# EAGLE design ENGI301_Maze_Project_frame (EAGLE 8.7.1)
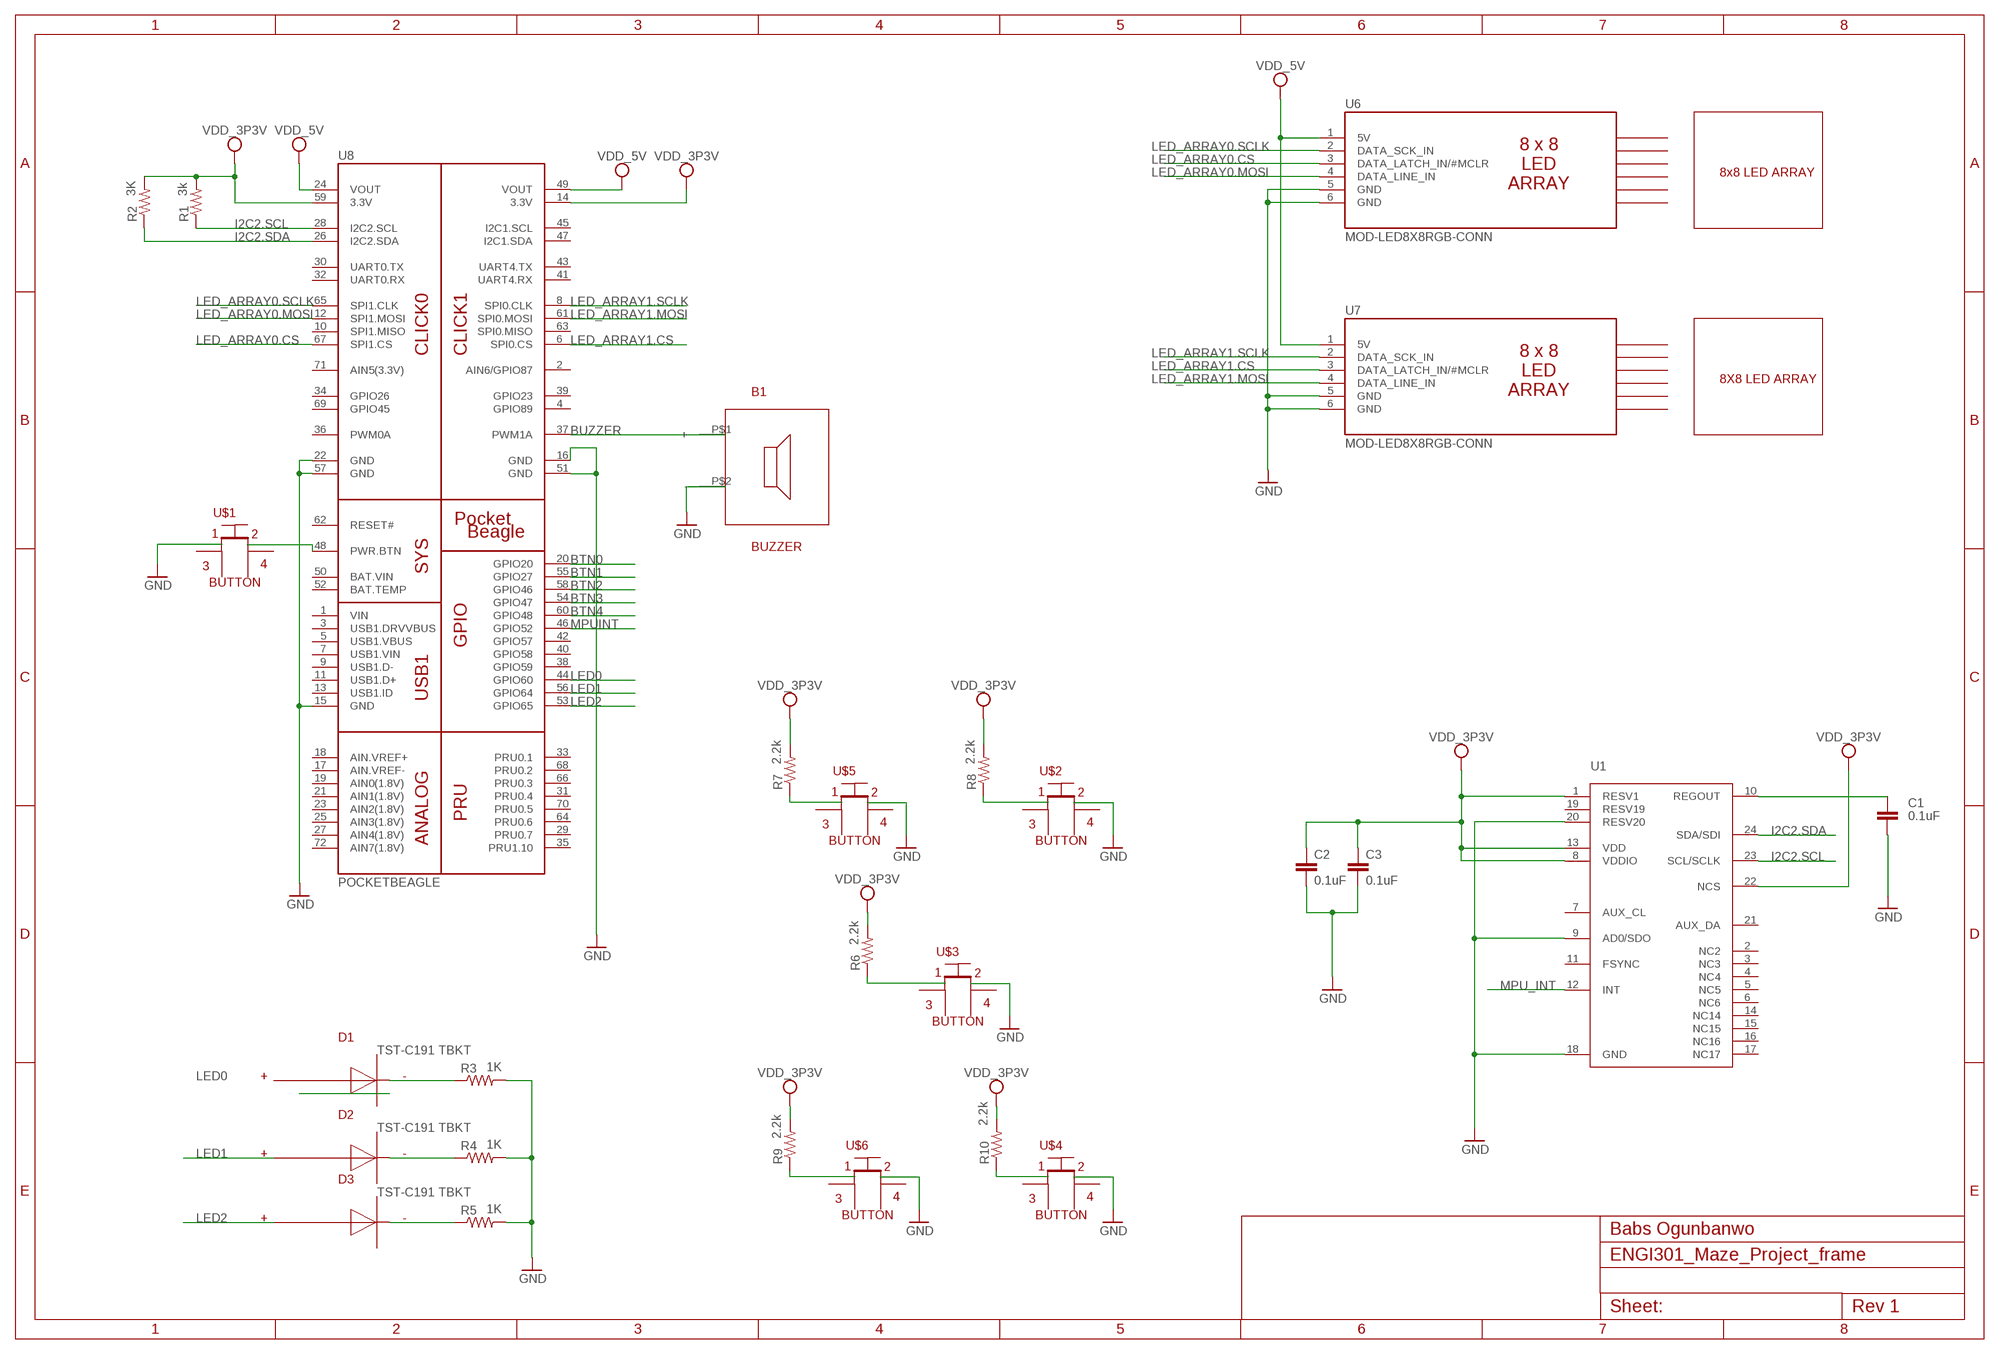
[diagram p0: schematic, sheet 1]

## Parts
B1  BUZZER  [BUZZER]
C1  0.1uF  C_C0603  [C0603]
C2  0.1uF  C_C0603  [C0603]
C3  0.1uF  C_C0603  [C0603]
D1  TST-C191 TBKT  LED  [LED]
D2  TST-C191 TBKT  LED  [LED]
D3  TST-C191 TBKT  LED  [LED]
R1  3k  R_R0603  [R0603]
R2  3K  R_R0603  [R0603]
R3  1K  R_R0603  [R0603]
R4  1K  R_R0603  [R0603]
R5  1K  R_R0603  [R0603]
R6  2.2k  R_R0603  [R0603]
R7  2.2k  R_R0603  [R0603]
R8  2.2k  R_R0603  [R0603]
R9  2.2k  R_R0603  [R0603]
R10  2.2k  R_R0603  [R0603]
U1  MPU-9250  [QFN-3MMX3MM]
U6  MOD-LED8X8RGB-CONN  [FE06W]
U7  MOD-LED8X8RGB-CONN  [FE06W]
U8  POCKETBEAGLE  [POCKETBEAGLE]
U$1  BUTTON  [BUTTON]
U$2  BUTTON  [BUTTON]
U$3  BUTTON  [BUTTON]
U$4  BUTTON  [BUTTON]
U$5  BUTTON  [BUTTON]
U$6  BUTTON  [BUTTON]

## Nets
BTN0: U8.20(GPIO20)
BTN1: U8.55(GPIO27)
BTN2: U8.58(GPIO46)
BTN3: U8.54(GPIO47)
BTN4: U8.60(GPIO48)
BUZZER: B1.P$1(+) U8.37(PWM1A)
GND: B1.P$2(-) C1.2 C2.2 C3.2 R3.2 R4.2 R5.2 U1.9(AD0/SDO) U1.20(RESV20) U6.5(GND) U6.6(GND) U7.5(GND) U7.6(GND) U8.15(GND) U8.16(GND) U8.22(GND) U8.51(GND) U8.57(GND) U$1.P$1 U$2.P$2 U$3.P$2 U$4.P$2 U$5.P$2 U$6.P$2
I2C2.SCL: R1.1 U1.23(SCL/SCLK) U8.28(I2C2.SCL)
I2C2.SDA: R2.1 U1.24(SDA/SDI) U8.26(I2C2.SDA)
LED0: D1.+ U8.44(GPIO60)
LED1: D2.+ U8.56(GPIO64)
LED2: D3.+ U8.53(GPIO65)
LED_ARRAY0.CS: U6.3(DATA_LATCH_IN/#MCLR) U8.67(SPI1.CS)
LED_ARRAY0.MOSI: U6.4(DATA_LINE_IN) U8.12(SPI1.MOSI)
LED_ARRAY0.SCLK: U6.2(DATA_SCK_IN) U8.65(SPI1.CLK)
LED_ARRAY1.CS: U7.3(DATA_LATCH_IN/#MCLR) U8.6(SPI0.CS)
LED_ARRAY1.MOSI: U7.4(DATA_LINE_IN) U8.61(SPI0.MOSI)
LED_ARRAY1.SCLK: U7.2(DATA_SCK_IN) U8.8(SPI0.CLK)
MPU_INT: U1.12(INT)
MPUINT: U8.46(GPIO52)
N$2: C1.1 U1.10(REGOUT)
N$3: U8.48(PWR.BTN) U$1.P$2
N$4: U1.18(GND)
N$5: D1.- R3.1
N$6: D2.- R4.1
N$7: D3.- R5.1
N$8: R7.1 U$5.P$1
N$9: R8.1 U$2.P$1
N$10: R6.1 U$3.P$1
N$11: R9.1 U$6.P$1
N$12: R10.1 U$4.P$1
SYS_VDD1_3P3V: C2.1 C3.1 R1.2 R2.2 R6.2 R7.2 R8.2 R9.2 R10.2 U1.1(RESV1) U1.8(VDDIO) U1.13(VDD) U1.22(NCS) U6.1(5V) U7.1(5V) U8.14(3.3V) U8.24(VOUT) U8.49(VOUT) U8.59(3.3V) ; supply symbol labelled VDD_5V, VDD_3P3V
Unconnected: U1.2(NC2) U1.3(NC3) U1.4(NC4) U1.5(NC5) U1.6(NC6) U1.7(AUX_CL) U1.11(FSYNC) U1.14(NC14) U1.15(NC15) U1.16(NC16) U1.17(NC17) U1.19(RESV19) U1.21(AUX_DA) U8.1(VIN) U8.2(AIN6/GPIO87) U8.3(USB1.DRVVBUS) U8.4(GPIO89) U8.5(USB1.VBUS) U8.7(USB1.VIN) U8.9(USB1.D-) U8.10(SPI1.MISO) U8.11(USB1.D+) U8.13(USB1.ID) U8.17(AIN.VREF-) U8.18(AIN.VREF+) U8.19(AIN0(1.8V)) U8.21(AIN1(1.8V)) U8.23(AIN2(1.8V)) U8.25(AIN3(1.8V)) U8.27(AIN4(1.8V)) U8.29(PRU0.7) U8.30(UART0.TX) U8.31(PRU0.4) U8.32(UART0.RX) U8.33(PRU0.1) U8.34(GPIO26) U8.35(PRU1.10) U8.36(PWM0A) U8.38(GPIO59) U8.39(GPIO23) U8.40(GPIO58) U8.41(UART4.RX) U8.42(GPIO57) U8.43(UART4.TX) U8.45(I2C1.SCL) U8.47(I2C1.SDA) U8.50(BAT.VIN) U8.52(BAT.TEMP) U8.62(RESET#) U8.63(SPI0.MISO) U8.64(PRU0.6) U8.66(PRU0.3) U8.68(PRU0.2) U8.69(GPIO45) U8.70(PRU0.5) U8.71(AIN5(3.3V)) U8.72(AIN7(1.8V)) U$1.P$3 U$1.P$4 U$2.P$3 U$2.P$4 U$3.P$3 U$3.P$4 U$4.P$3 U$4.P$4 U$5.P$3 U$5.P$4 U$6.P$3 U$6.P$4

## Notes on the sheet
- 8x8 LED ARRAY
- 8X8 LED ARRAY
- Babs Ogunbanwo

## Library data of the parts
B1 = ENGI301_design_example final:BUZZER
C1-C3 = ENGI301_design_example final:C_: Capacitor SMD. Sizes: 0402, 0603 & 0805
D1-D3 = ENGI301_design_example final:LED
R1-R10 = ENGI301_design_example final:R_: RESISTOR, American symbol
U1 = ENGI301_design_example final:MPU-9250
U6 U7 = ENGI301_Maze_Project_Parts:MOD-LED8X8RGB-CONN
U8 = ENGI301_Maze_Project_Parts:POCKETBEAGLE
U$1-U$6 = ENGI301_design_example final:BUTTON

## Board
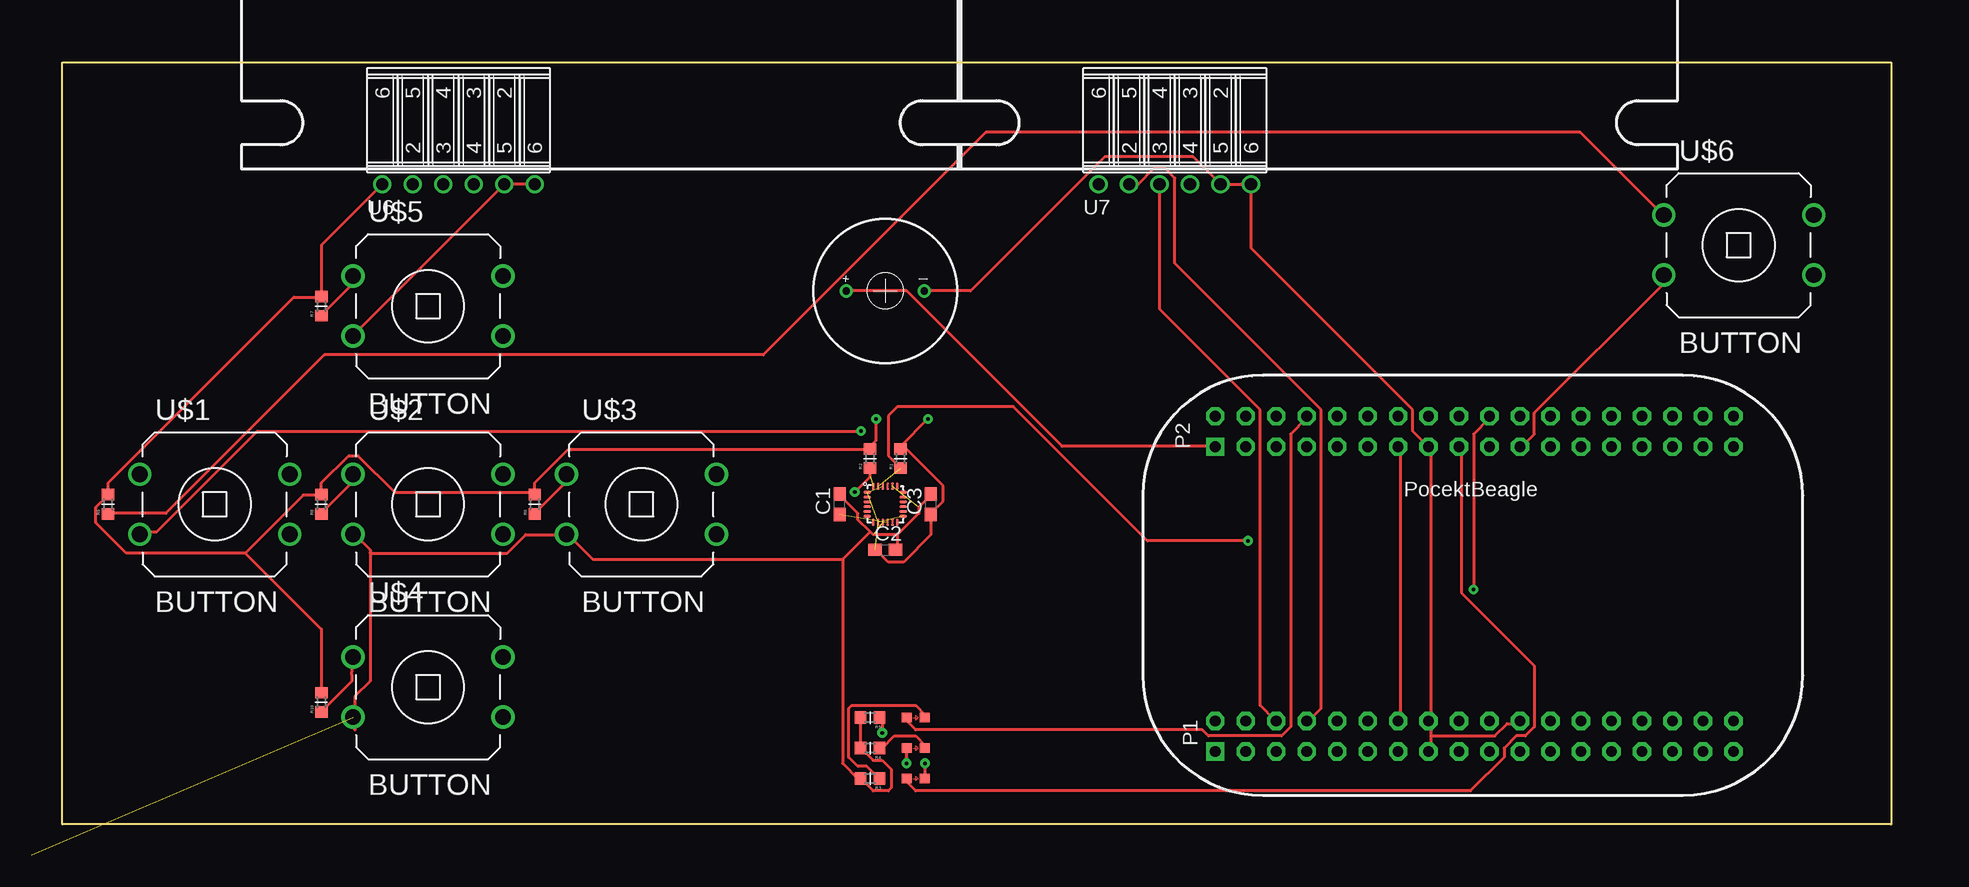
[diagram p1: board, top side]
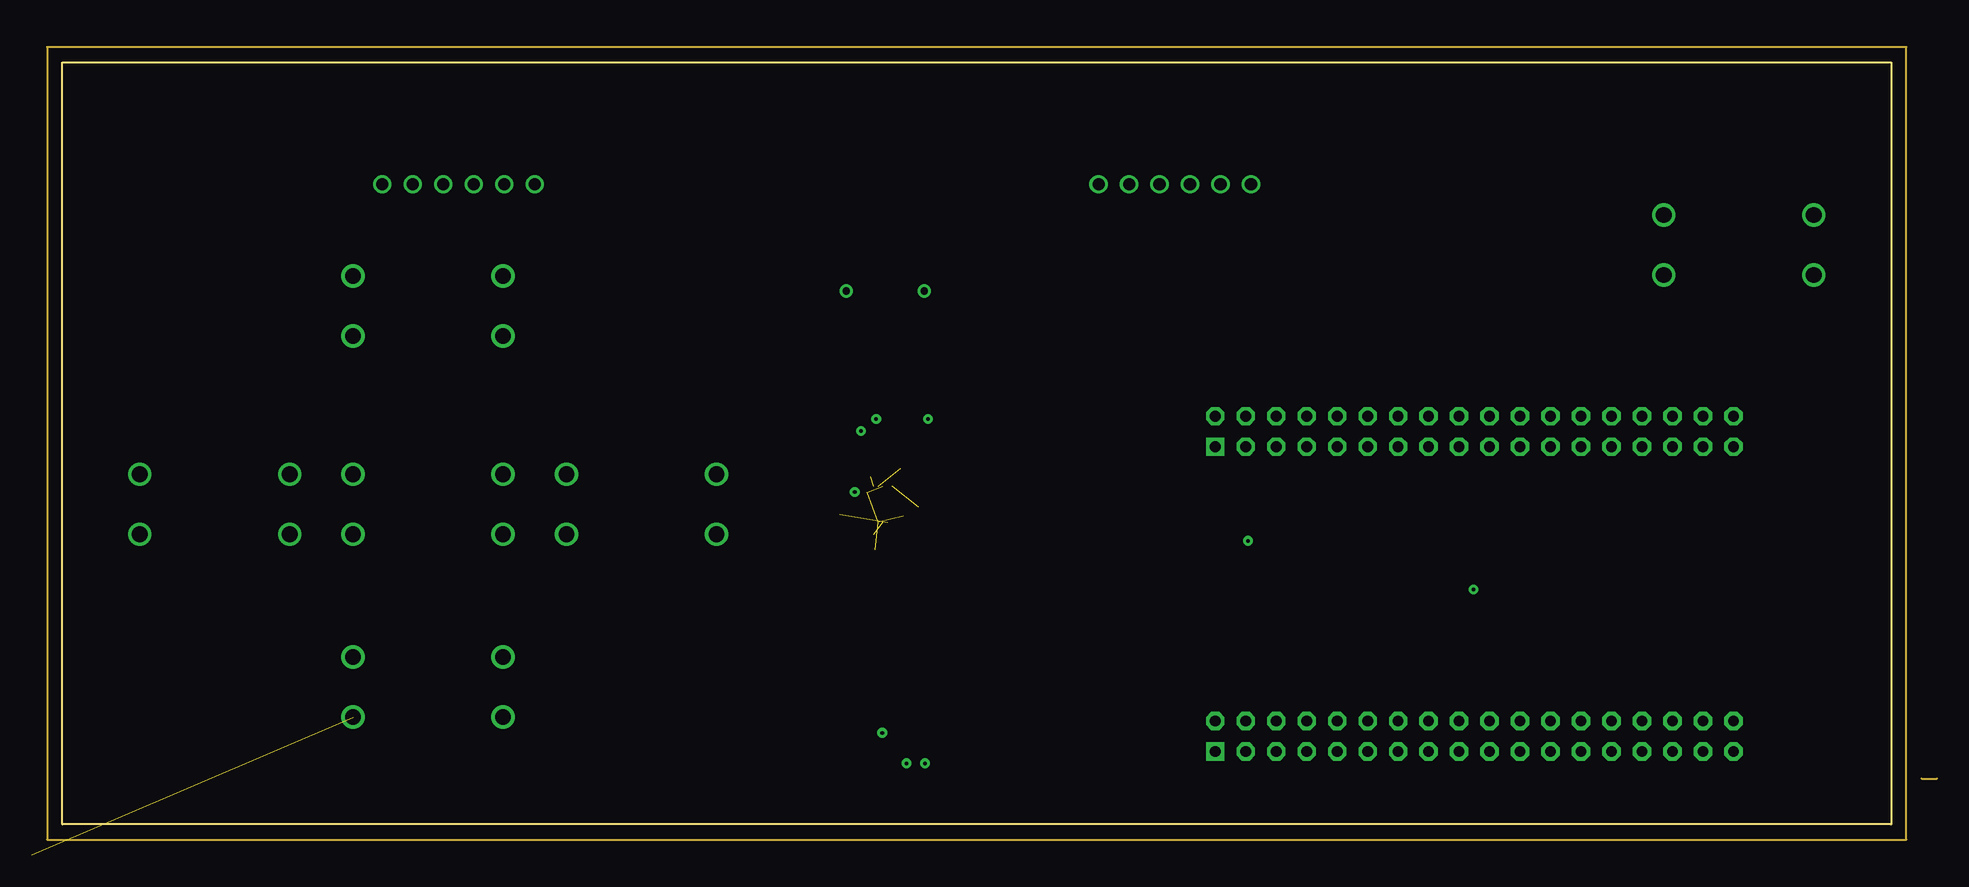
[diagram p2: board, inner layer Route2]
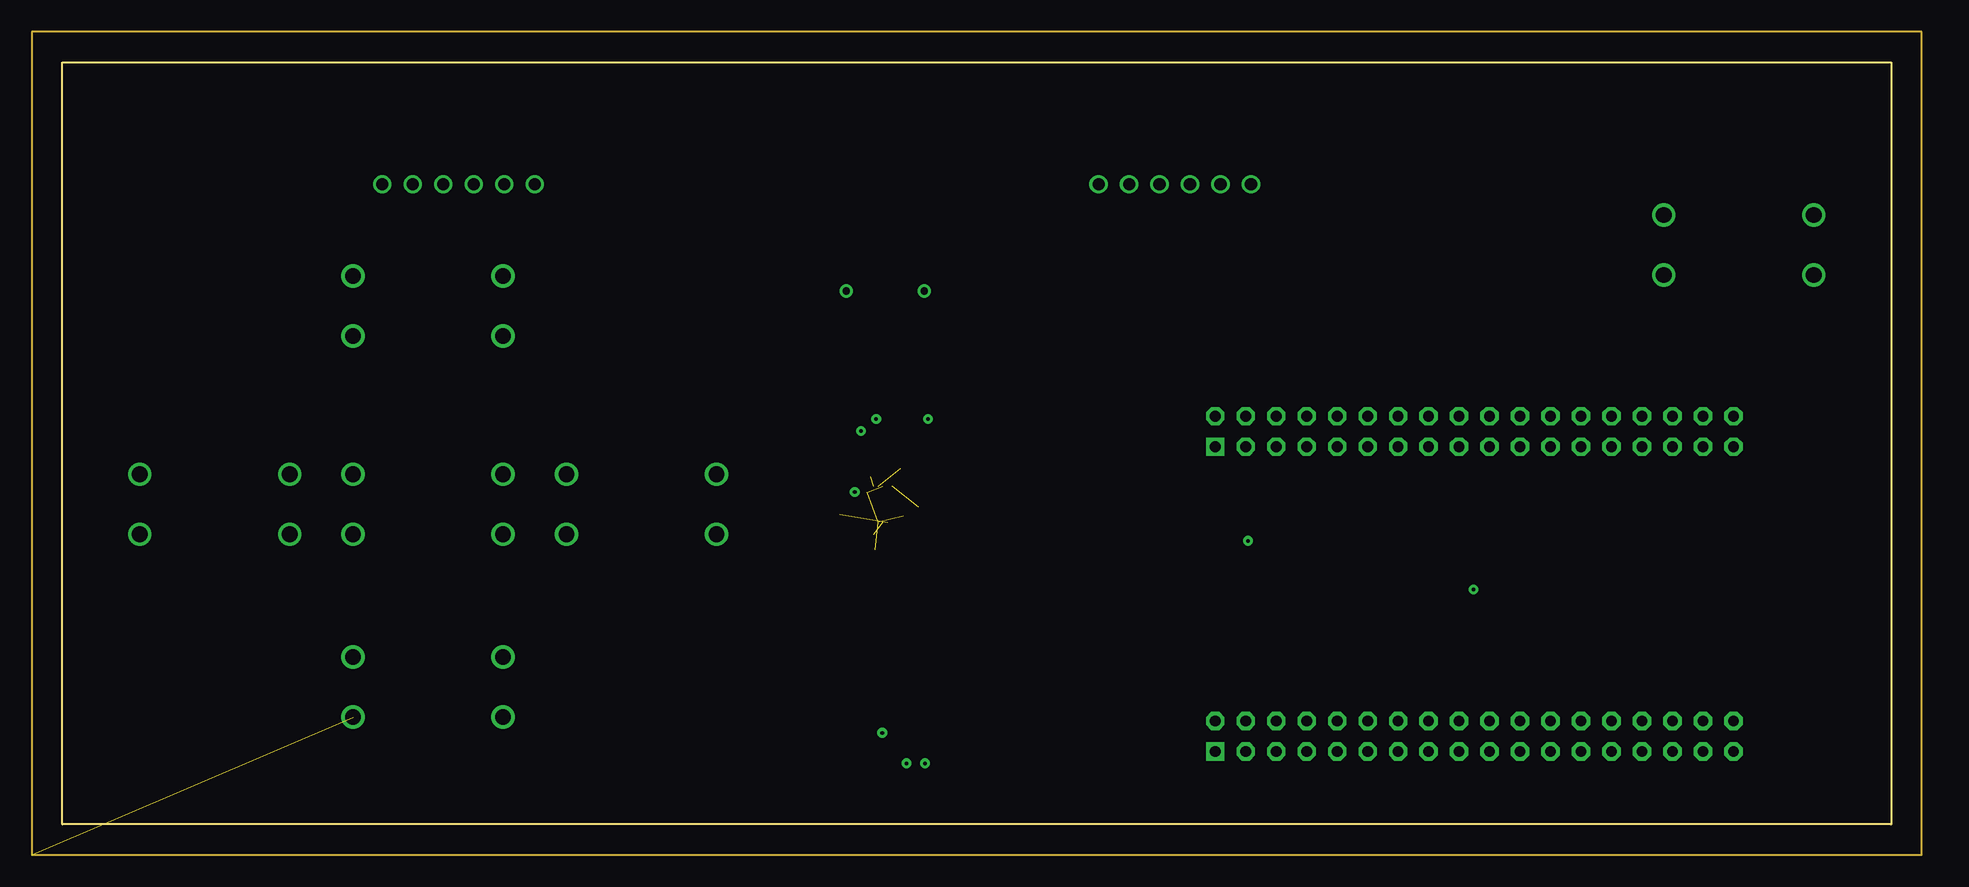
[diagram p3: board, inner layer Route15]
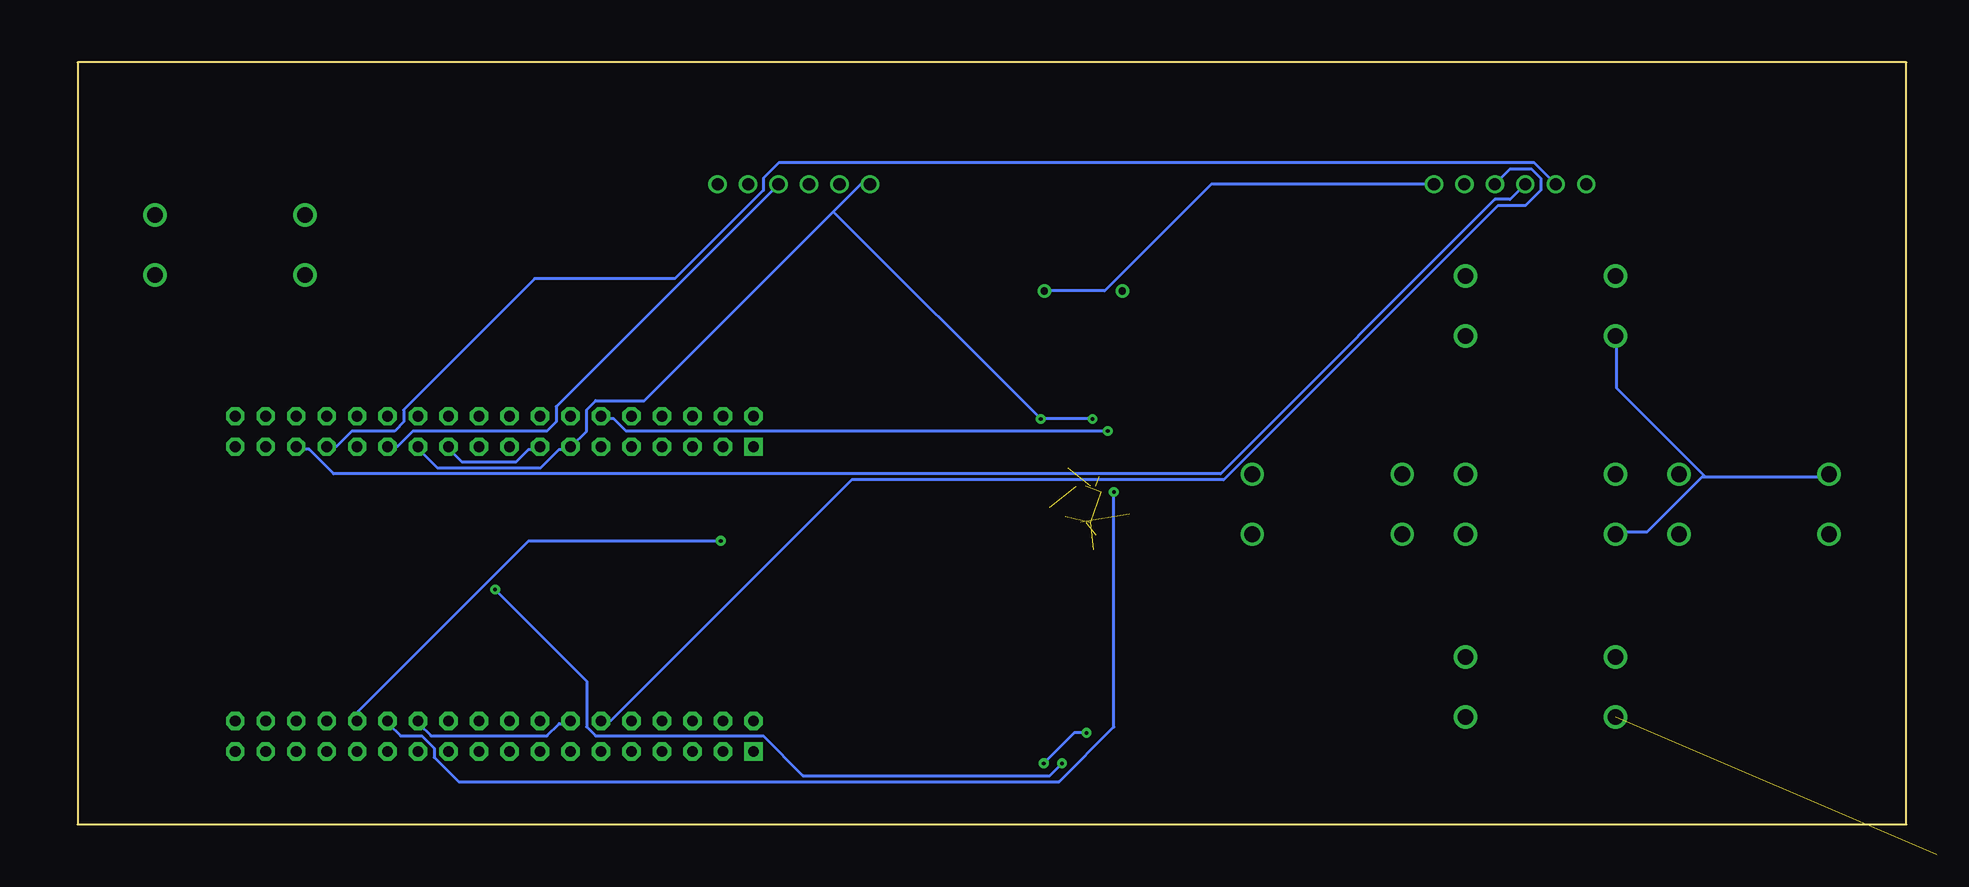
[diagram p4: board, bottom side, seen from below]

Size 152.4 x 63.5 mm. Coordinates in mm from the lower left corner, seen from the top.
Outline: 0,0 0,63.5 152.4,63.5 152.4,0 0,0
Copper layers (1*2*15*16): Top 0.035mm / dielectric 0.23mm / Route2 0.035mm / dielectric 0.93mm / Route15 0.035mm / dielectric 0.23mm / Bottom 0.035mm
Design rules "ENGI301_Maze_Project_4lyr": minimum track width 10mil, minimum drill 12mil, track to track 10mil, track to pad 10mil, pad to pad 10mil, via to via 10mil, smd to smd 10mil, copper to edge 10mil, drill to drill 12mil, minimum pad ring 10mil, minimum via ring 10mil, stop-mask expansion 3mil, vias tented up to drill 25mil, thermal gap 10mil

### Footprints (pad centres in the part's own frame; a part is rotated, then mirrored left to right if it is on the bottom)
BUZZER = drill 0.6: P$1 -3.25,0; P$2 3.25,0
C0603 = smd 1.1 x 1: 1 -0.85,0; 2 0.85,0
LED = smd 0.8 x 0.8: + -0.75,0; - 0.75,0
R0603 = smd 0.95 x 1.031: 1 -0.8,0; 2 0.8,0
QFN-3MMX3MM = smd 0.6 x 0.2: 1 -1.5,1; 2 -1.5,0.6; 3 -1.5,0.2; 4 -1.5,-0.2; 5 -1.5,-0.6; 6 -1.5,-1; 13 1.5,-1; 14 1.5,-0.6; 15 1.5,-0.2; 16 1.5,0.2; 17 1.5,0.6; 18 1.5,1 | smd 0.2 x 0.6: 7 -1,-1.5; 8 -0.6,-1.5; 9 -0.2,-1.5; 10 0.2,-1.5; 11 0.6,-1.5; 12 1,-1.5; 19 1,1.5; 20 0.6,1.5; 21 0.2,1.5; 22 -0.2,1.5; 23 -0.6,1.5; 24 -1,1.5
FE06W = drill 1.016: 1 -6.35,0; 2 -3.81,0; 3 -1.27,0; 4 1.27,0; 5 3.81,0; 6 6.35,0
POCKETBEAGLE = drill 0.889 pad 1.524 square: 1 5.91,3.53; 37 5.91,28.93 | drill 0.889 pad 1.524 octagon: 2 5.91,6.07; 3 8.45,3.53; 4 8.45,6.07; 5 10.99,3.53; 6 10.99,6.07; 7 13.53,3.53; 8 13.53,6.07; 9 16.07,3.53; 10 16.07,6.07; 11 18.61,3.53; 12 18.61,6.07; 13 21.15,3.53; 14 21.15,6.07; 15 23.69,3.53; 16 23.69,6.07; 17 26.23,3.53; 18 26.23,6.07; 19 28.77,3.53; 20 28.77,6.07; 21 31.31,3.53; 22 31.31,6.07; 23 33.85,3.53; 24 33.85,6.07; 25 36.39,3.53; 26 36.39,6.07; 27 38.93,3.53; 28 38.93,6.07; 29 41.47,3.53; 30 41.47,6.07; 31 44.01,3.53; 32 44.01,6.07; 33 46.55,3.53; 34 46.55,6.07; 35 49.09,3.53; 36 49.09,6.07; 38 5.91,31.47; 39 8.45,28.93; 40 8.45,31.47; 41 10.99,28.93; 42 10.99,31.47; 43 13.53,28.93; 44 13.53,31.47; 45 16.07,28.93; 46 16.07,31.47; 47 18.61,28.93; 48 18.61,31.47; 49 21.15,28.93; 50 21.15,31.47; 51 23.69,28.93; 52 23.69,31.47; 53 26.23,28.93; 54 26.23,31.47; 55 28.77,28.93; 56 28.77,31.47; 57 31.31,28.93; 58 31.31,31.47; 59 33.85,28.93; 60 33.85,31.47; 61 36.39,28.93; 62 36.39,31.47; 63 38.93,28.93; 64 38.93,31.47; 65 41.47,28.93; 66 41.47,31.47; 67 44.01,28.93; 68 44.01,31.47; 69 46.55,28.93; 70 46.55,31.47; 71 49.09,28.93; 72 49.09,31.47
BUTTON = drill 1.3: P$1 -6.25,2.5; P$2 -6.25,-2.5; P$3 6.25,2.5; P$4 6.25,-2.5

### Placement (x,y rotation side)
B1  68.58,44.45 0 top
C1  64.77,26.67 90 top
C2  68.58,22.86 0 top
C3  72.39,26.67 90 top
D1  71.12,8.89 0 top
D2  71.12,6.35 0 top
D3  71.12,3.81 0 top
R1  69.85,30.48 90 top
R2  67.31,30.48 90 top
R3  67.31,3.81 180 top
R4  67.31,6.35 180 top
R5  67.31,8.89 180 top
R6  39.37,26.67 90 top
R7  21.59,43.18 90 top
R8  21.59,26.67 90 top
R9  3.81,26.67 90 top
R10  21.59,10.16 90 top
U1  68.58,26.67 0 top
U6  33.02,53.34 0 top
U7  92.71,53.34 0 top
U8  90.17,2.54 0 top
U$1  12.7,26.67 0 top
U$2  30.48,26.67 0 top
U$3  48.26,26.67 0 top
U$4  30.48,11.43 0 top
U$5  30.48,43.18 0 top
U$6  139.7,48.26 0 top
U$7  [MOD-LED8X8RGB]  74.93,54.61 90 top
U$8  [MOD-LED8X8RGB]  134.62,54.61 90 top
U$9  [MOD-LED8X8RGB]  74.93,114.3 90 top  (outside the outline)
U$10  [MOD-LED8X8RGB]  134.62,114.3 90 top  (outside the outline)

### Tracks (layer width: path | path; a pad name or v marks a point on that pad's centre or on a via)
BUZZER
  Top 0.254: B1.P$1 70.36,44.45 83.31,31.5 96.01,31.5 U8.37
GND  (3 unrouted)
  Top 0.254: B1.P$2 75.69,44.45 86.87,55.63 94.23,55.63 U7.5 U7.6 99.06,48.01 112.52,34.54 112.52,32.77 113.79,31.5 U8.51 114.05,31.24 114.05,8.64 U8.16 114.05,8.38 114.05,7.37 | 114.05,7.37 114.05,6.1 U8.15 | 114.05,7.37 119.38,7.37 120.4,8.38 121.41,8.38 U8.22 | U$6.P$2 133.35,45.72 133.35,44.96 122.68,34.29 122.68,32.51 121.67,31.5 U8.57 | U6.6 U6.5 24.38,40.89 U$5.P$2 | 66.55,6.35 67.56,5.33 68.33,5.33 69.09,4.57 69.09,3.05 68.83,2.79 67.56,2.79 66.55,3.81 R3.2 66.29,3.81 65.02,5.08 65.02,22.1 | 66.55,6.35 66.55,8.89 R5.2 | 66.55,6.35 R4.2 | 69.6,24.13 69.6,22.86 C2.2 | 69.6,24.13 71.37,25.91 71.37,26.42 72.39,27.43 C3.2 | 67.31,24.38 67.56,24.13 69.6,24.13 | 67.31,24.38 66.29,25.4 66.29,25.91 64.77,27.43 C1.2 | 67.31,24.38 65.02,22.1 | 25.65,22.61 25.65,22.86 24.38,24.13 U$2.P$2 | 25.65,22.61 25.65,11.94 24.38,10.67 24.38,7.87 U$4.P$2 | 25.65,22.61 37.08,22.61 38.61,24.13 41.91,24.13 U$3.P$2 42.16,24.13 44.2,22.1 65.02,22.1
  Route15 0.152: -2.54,66.04 -2.54,-2.54 154.94,-2.54 154.94,66.04 -2.54,66.04
  Bottom 0.254: U8.51 114.05,31.24 114.81,31.24 115.82,30.23 120.4,30.23 121.41,31.24 U8.57 | 16.76,28.96 17.02,28.96 21.59,24.38 24.13,24.38 U$2.P$2 | 16.76,28.96 6.6,28.96 U$1.P$1 | 16.76,28.96 24.13,36.32 24.13,40.64 U$5.P$2 | B1.P$2 66.8,44.45 57.91,53.34 U6.6
I2C2.SCL  (via drill 0.3)  (1 unrouted)
  Top 0.254: v98.81,23.62 90.42,23.62 79.25,34.8 69.6,34.8 68.83,34.04 68.83,30.73 69.85,29.72 R1.1
  Bottom 0.254: v98.81,23.62 114.81,23.62 129.03,9.4 129.03,8.64 U8.28
I2C2.SDA  (via drill 0.3)  (1 unrouted)
  Top 0.254: R2.1 67.31,28.96 v66.04,27.69
  Bottom 0.254: v66.04,27.69 66.04,8.13 70.61,3.56 120.65,3.56 122.68,5.59 122.68,6.35 123.7,7.37 125.48,7.37 126.49,8.38 U8.26
LED0
  Top 0.254: D1.+ 70.36,8.89 70.36,8.64 71.12,7.87 95,7.87 95.5,7.37 101.6,7.37 102.36,8.13 102.36,32.51 103.63,33.78 U8.44
LED1  (via drill 0.3)
  Top 0.254: v70.36,5.08 70.36,6.35 D2.+ | v117.6,19.56 117.6,32.51 118.87,33.78 U8.56
  Bottom 0.254: v70.36,5.08 71.37,4.06 91.95,4.06 95.25,7.37 109.22,7.37 109.98,8.13 109.98,11.94 v117.6,19.56
LED2
  Top 0.254: D3.+ 70.36,3.81 70.36,3.56 71.12,2.79 117.35,2.79 120.14,5.59 120.14,6.35 121.16,7.37 121.92,7.37 122.68,8.13 122.68,13.21 116.59,19.3 116.59,31.24 U8.53
LED_ARRAY0.CS
  Bottom 0.254: U6.3 33.02,52.07 34.29,52.07 57.15,29.21 131.06,29.21 133.1,31.24 134.11,31.24 U8.67
LED_ARRAY0.MOSI
  Bottom 0.254: U6.4 33.02,54.61 31.24,54.61 30.48,53.85 30.48,52.83 31.75,51.56 34.04,51.56 56.9,28.7 87.88,28.7 107.95,8.64 108.71,8.64 U8.12
LED_ARRAY0.SCLK
  Bottom 0.254: U6.2 30.99,55.12 93.98,55.12 95.25,53.85 95.25,52.83 102.62,45.47 114.3,45.47 125.22,34.54 125.22,33.53 125.98,32.77 129.54,32.77 130.81,31.5 131.57,31.5 U8.65
LED_ARRAY1.CS
  Top 0.254: U7.3 91.44,42.93 99.82,34.54 99.82,9.91 101.09,8.64 U8.6
LED_ARRAY1.MOSI
  Bottom 0.254: U7.4 112.52,34.8 112.52,33.53 113.28,32.77 124.46,32.77 125.73,31.5 126.49,31.5 U8.61
LED_ARRAY1.SCLK
  Top 0.254: U7.2 89.66,53.34 90.93,54.61 91.95,54.61 92.71,53.85 92.71,46.74 104.9,34.54 104.9,9.65 103.89,8.64 U8.8
N$2  (1 unrouted)
N$3  (via drill 0.3)
  Top 0.254: v66.55,32.77 16.26,32.77 7.87,24.38 6.6,24.38 U$1.P$2
  Bottom 0.254: v66.55,32.77 106.68,32.77 107.7,33.78 108.71,33.78 U8.48
N$5
  Top 0.254: D1.- 71.88,8.89 71.88,9.14 71.12,9.91 65.79,9.91 65.53,9.65 65.53,5.59 66.29,4.83 67.06,4.83 68.07,3.81 R3.1
N$6
  Top 0.254: D2.- 71.88,6.35 71.88,6.6 71.12,7.37 69.34,7.37 68.33,6.35 R4.1
N$7  (via drill 0.3)
  Top 0.254: v71.88,5.08 71.88,3.81 D3.- | v68.33,7.62 68.33,8.89 R5.1
  Bottom 0.254: v71.88,5.08 69.34,7.62 v68.33,7.62
N$8
  Top 0.254: R7.1 21.59,42.42 24.13,44.96 24.13,45.47 U$5.P$1
N$9
  Top 0.254: R8.1 21.59,25.91 24.13,28.45 24.13,28.96 U$2.P$1
N$10
  Top 0.254: R6.1 39.37,25.91 41.91,28.45 41.91,28.96 U$3.P$1
N$11
  Top 0.254: R9.1 3.81,25.91 8.64,25.91 21.84,39.12 58.42,39.12 76.96,57.66 126.49,57.66 133.35,50.8 U$6.P$1
N$12
  Top 0.254: R10.1 21.59,9.4 24.13,11.94 24.13,12.45 U$4.P$1
N$13
  Route2 0.152: 154.94,3.81 156.21,3.81
SYS_VDD1_3P3V  (via drill 0.3)  (4 unrouted)
  Top 0.254: C2.1 67.82,22.86 68.83,21.84 70.1,21.84 72.39,24.13 C3.1 72.39,25.91 73.41,26.92 73.41,28.19 70.36,31.24 69.85,31.24 R1.2 69.85,31.5 v72.14,33.78 | U8.14 111.51,8.64 111.51,31.24 U8.49 | U6.1 21.59,48.26 R7.2 21.59,43.94 19.3,43.94 3.81,28.45 R9.2 3.81,27.43 2.79,26.42 2.79,25.15 5.33,22.61 15.24,22.61 | 15.24,22.61 20.07,27.43 21.59,27.43 R8.2 21.59,28.45 23.88,30.73 24.64,30.73 27.69,27.69 39.37,27.69 | R10.2 21.59,16.26 15.24,22.61 | 39.37,27.69 39.37,28.45 42.16,31.24 67.31,31.24 R2.2 67.31,31.5 67.82,32 v67.82,33.78 | 39.37,27.69 R6.2
  Bottom 0.254: U8.14 111.51,8.38 112.27,8.38 113.28,7.37 122.94,7.37 123.95,8.38 U8.24 | U8.59 123.95,31.24 122.43,29.72 113.79,29.72 112.27,31.24 111.51,31.24 U8.49 111.25,31.5 109.98,32.77 109.98,34.54 109.22,35.31 105.16,35.31 89.41,51.05 | U7.1 87.12,53.34 89.41,51.05 | 89.41,51.05 v72.14,33.78 v67.82,33.78
VDD_3P3V
  Route2 0.152: -1.27,64.77 -1.27,-1.27 153.67,-1.27 153.67,64.77 -1.27,64.77